# Altium project ARDUINO_LASER.PrjPcb
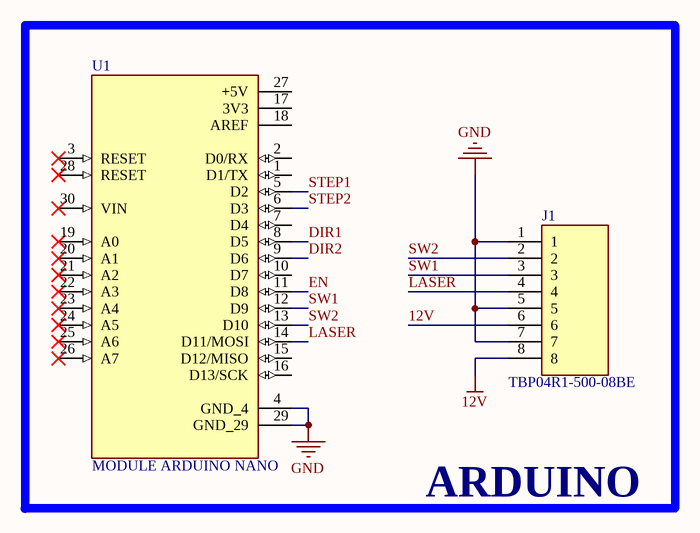
[diagram p0: MCU.SchDoc]
2 sheets, 9 parts. Net scope: global (net labels, ports and power ports of the same name join across sheets).
Board file: PCB.PcbDoc
Sheets:
  MCU.SchDoc
  DRIVER.SchDoc

## Sheet MCU.SchDoc
size A4; SheetNumber: 1; SheetTotal: 2

### Parts
J1  TBP04R1-500-08BE  [TBP04R1-500-08BE]
U1  MODULE ARDUINO NANO  [MODULE ARDUINO NANO]

### Blocks framed on the sheet
ARDUINO: J1 U1

### Nets
12V: J1.6 J1.8
GND: J1.1 J1.5 J1.7 U1.4(GND_4) U1.29(GND_29)
DIR1: U1.8(D5)
DIR2: U1.9(D6)
EN: U1.11(D8)
LASER: J1.4 U1.14(D11/MOSI)
STEP1: U1.5(D2)
STEP2: U1.6(D3)
SW1: J1.3 U1.12(D9)
SW2: J1.2 U1.13(D10)

Not connected (* = marked no-connect by the designer): U1 1(D1/TX) 2(D0/RX) 3(RESET)* 7(D4) 10(D7) 15(D12/MISO) 16(D13/SCK) 17(3V3) 18(AREF) 19(A0)* 20(A1)* 21(A2)* 22(A3)* 23(A4)* 24(A5)* 25(A6)* 26(A7)* 27(+5V) 28(RESET)* 30(VIN)*

### Library data of the parts
J1 = TBP04R1-500-08BE: 2~24 Poles, Pluggable, Receptacle, Horizontal, 5.0 Pitch, Terminal Block Connector; MF: Same Sky; SnapEDA_Link: https://www.snapeda.com/parts/TBP04R1-500-08BE/Same+Sky/view-part/?ref=snap; Package: None; Value: *; MP: TBP04R1-500-08BE; Check_prices: https://www.snapeda.com/parts/TBP04R1-500-08BE/Same+Sky/view-part/?ref=eda
U1 = MODULE ARDUINO NANO: Small, complete, and breadboard-friendly board based on the ATmega328 (Arduino Nano 3.x); SnapEDA_Link: https://www.snapeda.com/parts/Arduino%20Nano/Arduino/view-part/?ref=snap; Package: Non-Standard Arduino; Value: *; MF: Arduino; MP: Arduino Nano; Check_prices: https://www.snapeda.com/parts/Arduino%20Nano/Arduino/view-part/?ref=eda

## Sheet DRIVER.SchDoc
size A4; SheetNumber: 2; SheetTotal: 2
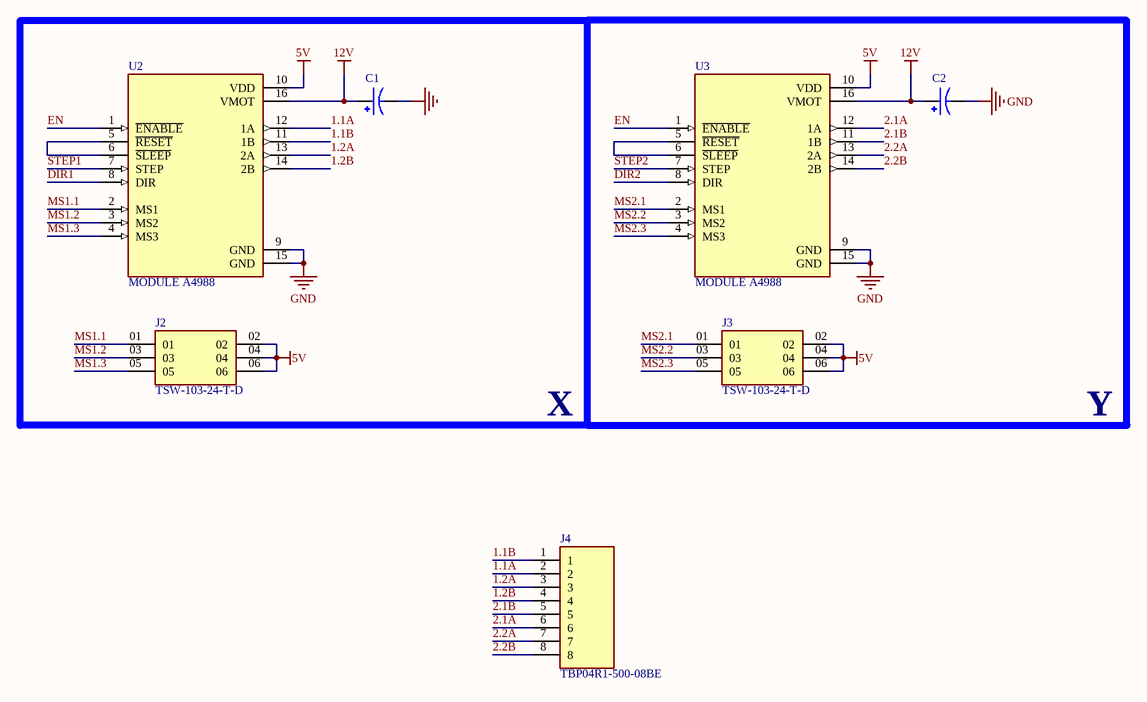
[diagram p1: DRIVER.SchDoc]

### Parts
C1  EEUFR1V101B  [EEU-FR1V101B]  (value not drawn)
C2  EEUFR1V101B  [EEU-FR1V101B]  (value not drawn)
J2  TSW-103-24-T-D  [TSW-103-24-T-D]
J3  TSW-103-24-T-D  [TSW-103-24-T-D]
J4  TBP04R1-500-08BE  [TBP04R1-500-08BE]
U2  MODULE A4988  [MODULE A4988]
U3  MODULE A4988  [MODULE A4988]

### Blocks framed on the sheet
X: C1 J2 U2
Y: C2 J3 U3

### Nets
5V: J2.02 J2.04 J2.06 J3.02 J3.04 J3.06 U2.10(VDD) U3.10(VDD)
12V: C1.P C2.P U2.16(VMOT) U3.16(VMOT)
GND: C1.N C2.N U2.9(GND) U2.15(GND) U3.9(GND) U3.15(GND)
1.1A: J4.2 U2.12(1A)
1.1B: J4.1 U2.11(1B)
1.2A: J4.3 U2.13(2A)
1.2B: J4.4 U2.14(2B)
2.1A: J4.6 U3.12(1A)
2.1B: J4.5 U3.11(1B)
2.2A: J4.7 U3.13(2A)
2.2B: J4.8 U3.14(2B)
DIR1: U2.8(DIR)
DIR2: U3.8(DIR)
EN: U2.1(~{ENABLE}) U3.1(~{ENABLE})
MS1.1: J2.01 U2.2(MS1)
MS1.2: J2.03 U2.3(MS2)
MS1.3: J2.05 U2.4(MS3)
MS2.1: J3.01 U3.2(MS1)
MS2.2: J3.03 U3.3(MS2)
MS2.3: J3.05 U3.4(MS3)
STEP1: U2.7(STEP)
STEP2: U3.7(STEP)
NetU2_5: U2.5(~{RESET}) U2.6(~{SLEEP})
NetU3_5: U3.5(~{RESET}) U3.6(~{SLEEP})

### Library data of the parts
C1 C2 = EEUFR1V101B: AL LYTIC, RADIAL, 35VDC, 100UF; MF: Panasonic; MP: EEUFR1V101B; Value: *; Check_prices: https://www.snapeda.com/parts/EEUFR1V101B/Panasonic/view-part/5790218/?ref=eda; SnapEDA_Link: https://www.snapeda.com/parts/EEUFR1V101B/Panasonic/view-part/5790218/?ref=snap; Price: None; Availability: In Stock; Package: RADIAL-2 Panasonic
J2 J3 = TSW-103-24-T-D: TSW - 2.54mm Samtec Pin Header 12.15mm Overall Pin Length (24) - Fast Stock(mcv); Price: None; Value: *; MP: TSW-103-24-T-D; Package: None; Availability: Unavailable
J4 = TBP04R1-500-08BE: as J1 on sheet MCU; SnapEDA_Link: https://www.snapeda.com/parts/TBP04R1-500-08BE/Same+Sky/view-part/?ref=snap; Package: None; Value: *; MP: TBP04R1-500-08BE; Check_prices: https://www.snapeda.com/parts/TBP04R1-500-08BE/Same+Sky/view-part/?ref=eda
U2 U3 = MODULE A4988: Stepper motor controler; IC: A4988; 1A; Uin mot: 8Ã·35V; MP: A4988_STEPPER_MOTOR_DRIVER_CARRIER; Price: None; Value: *; Package: None; Availability: Unavailable

## Nets that join several sheets
12V: MCU (J1.6 J1.8), DRIVER (C1.P C2.P U2.16 U3.16)
GND: MCU (5 pins), DRIVER (6 pins)
DIR1: MCU (U1.8), DRIVER (U2.8)
DIR2: MCU (U1.9), DRIVER (U3.8)
EN: MCU (U1.11), DRIVER (U2.1 U3.1)
STEP1: MCU (U1.5), DRIVER (U2.7)
STEP2: MCU (U1.6), DRIVER (U3.7)